# Altium project SeniorDesign_RealMixPro.PrjPcb
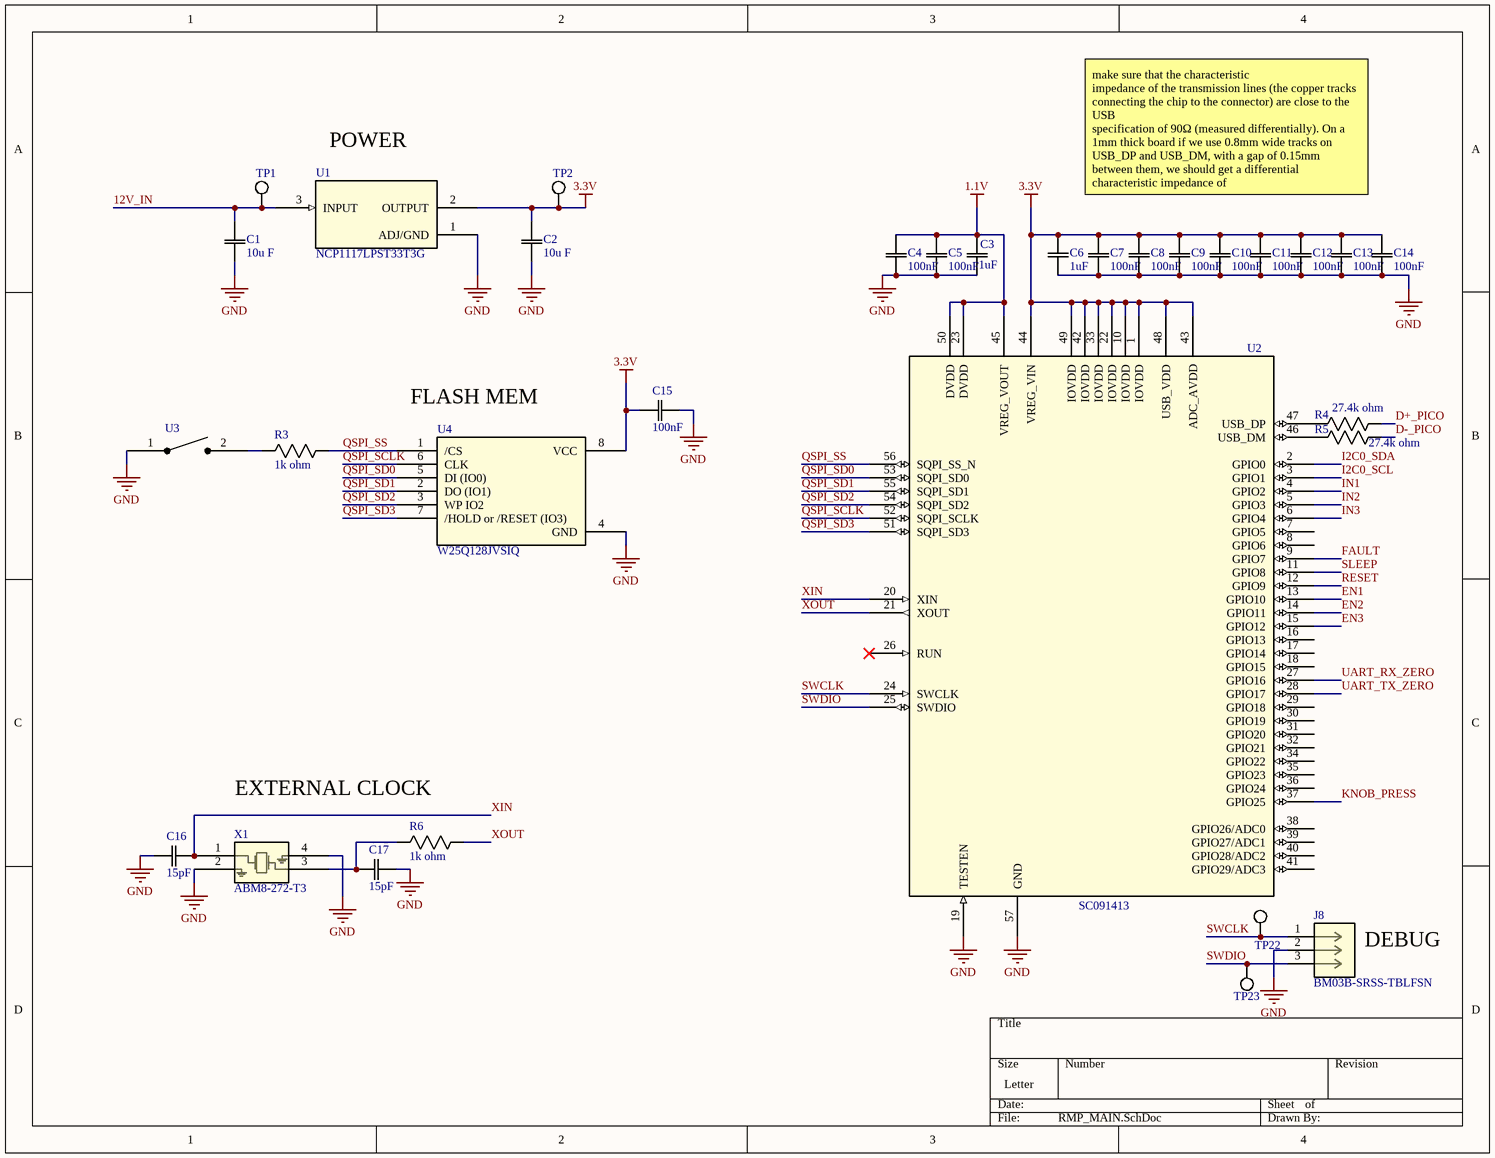
[diagram p0: RMP_MAIN.SchDoc]
7 sheets, 220 parts. Net scope: global (net labels, ports and power ports of the same name join across sheets).
Board files: RMP_MAIN_PCB.PcbDoc, RMP_MAIN_SINGLE.PcbDoc
Sheets:
  RMP_MAIN.SchDoc
  RMP_LED_MODULE.SchDoc
  RMP_MAIN_HFB.SchDoc
  RMP_SLIDER_MODULE.SchDoc
  RMP_MACRO_MODULE.SchDoc
  RMP_MAIN_ZERO.SchDoc
  USB_HUB.SchDoc

## Sheet RMP_MAIN.SchDoc
size Letter; SheetNumber: 1; SheetTotal: 7

### Parts
C1  value 10u F  [G-21_MUR-M]  (hidden comment: GRM21BR61C106KE15K)
C2  value 10u F  [G-21_MUR-M]  (hidden comment: GRM21BR61C106KE15K)
C3  value 1uF  [CAPC17595_90N_KEM-M]  (hidden comment: C0603C105K4RACTU)
C4  value 100nF  [CC0603N_YAG-M]  (hidden comment: CC0603KRX7R7BB104)
C5  value 100nF  [CC0603N_YAG-M]  (hidden comment: CC0603KRX7R7BB104)
C6  value 1uF  [CAPC17595_90N_KEM-M]  (hidden comment: C0603C105K4RACTU)
C7  value 100nF  [CC0603N_YAG-M]  (hidden comment: CC0603KRX7R7BB104)
C8  value 100nF  [CC0603N_YAG-M]  (hidden comment: CC0603KRX7R7BB104)
C9  value 100nF  [CC0603N_YAG-M]  (hidden comment: CC0603KRX7R7BB104)
C10  value 100nF  [CC0603N_YAG-M]  (hidden comment: CC0603KRX7R7BB104)
C11  value 100nF  [CC0603N_YAG-M]  (hidden comment: CC0603KRX7R7BB104)
C12  value 100nF  [CC0603N_YAG-M]  (hidden comment: CC0603KRX7R7BB104)
C13  value 100nF  [CC0603N_YAG-M]  (hidden comment: CC0603KRX7R7BB104)
C14  value 100nF  [CC0603N_YAG-M]  (hidden comment: CC0603KRX7R7BB104)
C15  value 100nF  [CC0603N_YAG-M]  (hidden comment: CC0603KRX7R7BB104)
C16  value 15pF  [CAP_CC0805_YAG-M]  (hidden comment: CC0805FRNPO9BN150)
C17  value 15pF  [CAP_CC0805_YAG-M]  (hidden comment: CC0805FRNPO9BN150)
J8  BM03B-SRSS-TBLFSN  [CONN_BM03B-SRSS-TBLFSN_JST]
R3  value 1k ohm  [RES_RNCF0805_STP-M]  (hidden comment: RNCF0805DTE1K00)
R4  value 27.4k ohm  [RESC1508X55N]  (hidden comment: MCT06030C2742FP500)
R5  value 27.4k ohm  [RESC1508X55N]  (hidden comment: MCT06030C2742FP500)
R6  value 1k ohm  [RES_RNCF0805_STP-M]  (hidden comment: RNCF0805DTE1K00)
TP1  TestPoint  [Testpoint]  (value not drawn)
TP2  TestPoint  [Testpoint]  (value not drawn)
TP22  TestPoint  [Testpoint]  (value not drawn)
TP23  TestPoint  [Testpoint]  (value not drawn)
U1  NCP1117LPST33T3G  [SOT223-3_ONS-M]
U2  SC091413  [QFN56_7X7_RPI-M]
U3  PTS636SM43SMTR LFS  [PTS636SM43SMTR LFS]  (value not drawn)
U4  W25Q128JVSIQ  [SOIC_128JVSIQ_WIN-M]
X1  ABM8-272-T3  [ABM8-272-T3_ABR]

### Nets
1.1V: C3.2 C4.2 C5.2 U2.23(DVDD) U2.45(VREG_VOUT) U2.50(DVDD)
3.3V: C2.2 C6.1 C7.2 C8.2 C9.2 C10.2 C11.2 C12.2 C13.2 C14.2 C15.2 TP2.1 U1.2(OUTPUT) U2.1(IOVDD) U2.10(IOVDD) U2.22(IOVDD) U2.33(IOVDD) U2.42(IOVDD) U2.43(ADC_AVDD) U2.44(VREG_VIN) U2.48(USB_VDD) U2.49(IOVDD) U4.8(VCC)
GND: C1.1 C2.1 C3.1 C4.1 C5.1 C6.2 C7.1 C8.1 C9.1 C10.1 C11.1 C12.1 C13.1 C14.1 C15.1 C16.1 C17.2 J8.2 U1.1(ADJ/GND) U2.19(TESTEN) U2.57(GND) U3.1 U4.4(GND) X1.2 X1.4
12V_IN: C1.2 TP1.1 U1.3(INPUT)
D+_PICO: R4.2
D-_PICO: R5.2
EN1: U2.13(GPIO10)
EN2: U2.14(GPIO11)
EN3: U2.15(GPIO12)
FAULT: U2.9(GPIO7)
I2C0_SCL: U2.3(GPIO1)
I2C0_SDA: U2.2(GPIO0)
IN1: U2.4(GPIO2)
IN2: U2.5(GPIO3)
IN3: U2.6(GPIO4)
KNOB_PRESS: U2.37(GPIO25)
QSPI_SCLK: U2.52(SQPI_SCLK) U4.6(CLK)
QSPI_SD0: U2.53(SQPI_SD0) U4.5(DI_(IO0))
QSPI_SD1: U2.55(SQPI_SD1) U4.2(DO_(IO1))
QSPI_SD2: U2.54(SQPI_SD2) U4.3(WP_IO2)
QSPI_SD3: U2.51(SQPI_SD3) U4.7(/HOLD_or_/RESET_(IO3))
QSPI_SS: R3.2 U2.56(SQPI_SS_N) U4.1(/CS)
RESET: U2.12(GPIO9)
SLEEP: U2.11(GPIO8)
SWCLK: J8.1 TP22.1 U2.24(SWCLK)
SWDIO: J8.3 TP23.1 U2.25(SWDIO)
UART_RX_ZERO: U2.27(GPIO16)
UART_TX_ZERO: U2.28(GPIO17)
XIN: C16.2 U2.20(XIN) X1.1
XOUT: R6.2 U2.21(XOUT)
NetC17_1: C17.1 R6.1 X1.3
NetR3_1: R3.1 U3.2
NetR4_1: R4.1 U2.47(USB_DP)
NetR5_1: R5.1 U2.46(USB_DM)

Not connected (* = marked no-connect by the designer): U2 7(GPIO5) 8(GPIO6) 16(GPIO13) 17(GPIO14) 18(GPIO15) 26(RUN)* 29(GPIO18) 30(GPIO19) 31(GPIO20) 32(GPIO21) 34(GPIO22) 35(GPIO23) 36(GPIO24) 38(GPIO26/ADC0) 39(GPIO27/ADC1) 40(GPIO28/ADC2) 41(GPIO29/ADC3)

### Notes on the sheet
- POWER
- make sure that the characteristic
  impedance of the transmission lines (the copper tracks connecting the chip to the connector) are close to the USB
  specification of 90Ω (measured differentially). On a 1mm thick board if we use 0.8mm wide tracks on
  USB_DP and USB_DM, with a gap of 0.15mm between them, we should get a differential characteristic impedance of
  around 90Ω
- (near U4) FLASH MEM
- EXTERNAL CLOCK
- (near J8) DEBUG

### Library data of the parts
C1 C2 = CAP_GRM21BR61C106KE15K: 10 µF ±10% 16V Ceramic Capacitor X5R 0805 (2012 Metric); Mfr_Name: Murata
C3 C6 = CAP_C0603C105K4RACTU: 1 µF ±10% 16V Ceramic Capacitor X7R 0603 (1608 Metric); Mfr_Name: Kemet
C4 C5 C7-C15 = CAP_CC0603KRX7R7BB104: 0.1 µF ±10% 16V Ceramic Capacitor X7R 0603 (1608 Metric); Mfr_Name: Yageo
C16 C17 = CAP_CC0805FRNPO9BN150: 15 pF ±1% 50V Ceramic Capacitor C0G, NP0 0805 (2012 Metric); Mfr_Name: Yageo
J8 = BM03B-SRSS-TBLFSN: No Description Available; Mfr_Name: JST; RefDes: RefDes; Type: Type
R3 R6 = RES_RNCF0805DTE1K00: 1 kOhms ±0.5% 0.25W, 1/4W Chip Resistor 0805 (2012 Metric) Automotive AEC-Q200 Thin Film; Mfr_Name: Stackpole International
R4 R5 = RES_MCT06030C2742FP500: 27.4 kOhms ±1% 0.125W, 1/8W Chip Resistor 0603 (1608 Metric) Anti-Sulfur Thin Film; Mfr_Name: Stackpole International
U1 = NCP1117LPST33T3G: Linear Voltage Regulator IC Positive Fixed 1 Output 1A SOT-223; Mfr_Name: onsemi; RefDes: RefDes; Type: Type
U2 = SC091413: ARM® Cortex®-M0+ - Microcontroller IC 32-Bit Dual-Core 133MHz External Program Memory 56-QFN (7x7); Mfr_Name: Raspberry Pi; Type: Embedded; RefDes: RefDes
U3 = PTS636SM43SMTR LFS: Tactile Switch SPST-NO Top Actuated Surface Mount
U4 = W25Q128JVSIQ: FLASH - NOR Memory IC 128Mbit SPI - Quad I/O, QPI 133 MHz 8-SOIC; Mfr_Name: Winbond; RefDes: RefDes; Type: Type
X1 = ABM8-272-T3: 12 MHz ±30ppm Crystal 10pF 50 Ohms 4-SMD, No Lead; Mfr_Name: Abracon; Type: Crystals; RefDes: RefDes

## Sheet RMP_LED_MODULE.SchDoc
size Letter; SheetNumber: 2; SheetTotal: 7
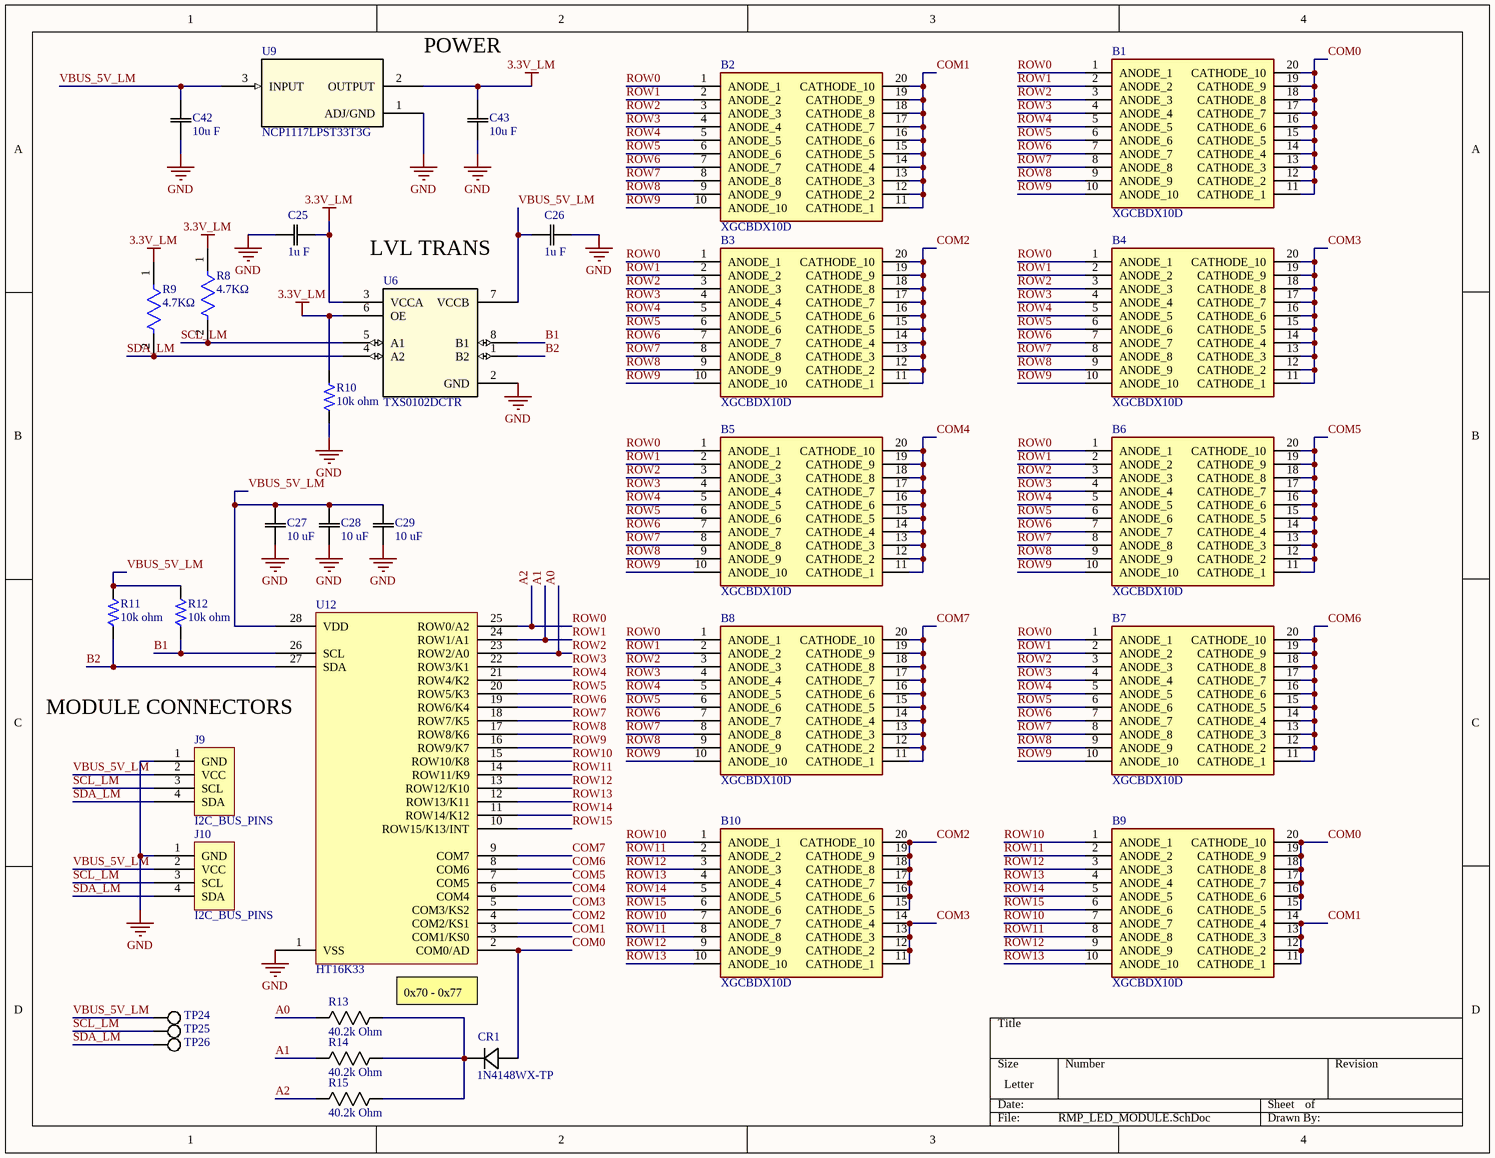
[diagram p1: RMP_LED_MODULE.SchDoc]

### Parts
B1  XGCBDX10D  [DIPS750W75P254L2540H825Q20N]
B2  XGCBDX10D  [DIPS750W75P254L2540H825Q20N]
B3  XGCBDX10D  [DIPS750W75P254L2540H825Q20N]
B4  XGCBDX10D  [DIPS750W75P254L2540H825Q20N]
B5  XGCBDX10D  [DIPS750W75P254L2540H825Q20N]
B6  XGCBDX10D  [DIPS750W75P254L2540H825Q20N]
B7  XGCBDX10D  [DIPS750W75P254L2540H825Q20N]
B8  XGCBDX10D  [DIPS750W75P254L2540H825Q20N]
B9  XGCBDX10D  [DIPS750W75P254L2540H825Q20N]
B10  XGCBDX10D  [DIPS750W75P254L2540H825Q20N]
C25  value 1u F  [CAP_CL21B105KAFNNNE_SAM-M]  (hidden comment: CL21B105KAFNNNE)
C26  value 1u F  [CAP_CL21B105KAFNNNE_SAM-M]  (hidden comment: CL21B105KAFNNNE)
C27  value 10 uF  [CAP_CL21_SAM-M]  (hidden comment: CL21A106KOQNNNE)
C28  value 10 uF  [CAP_CL21_SAM-M]  (hidden comment: CL21A106KOQNNNE)
C29  value 10 uF  [CAP_CL21_SAM-M]  (hidden comment: CL21A106KOQNNNE)
C42  value 10u F  [G-21_MUR-M]  (hidden comment: GRM21BR61C106KE15K)
C43  value 10u F  [G-21_MUR-M]  (hidden comment: GRM21BR61C106KE15K)
CR1  1N4148WX-TP  [CR_SOD323_MCC-M]
J9  I2C_BUS_PINS  [4 PIN HEADER]
J10  I2C_BUS_PINS  [4 PIN HEADER]
R8  Resistance: 4.7KΩ  [FP-RT0805-MFG]  (hidden comment: RT0805FRE134K7L)
R9  Resistance: 4.7KΩ  [FP-RT0805-MFG]  (hidden comment: RT0805FRE134K7L)
R10  value 10k ohm  [STA_RNCP0805_STP-M]  (hidden comment: RNCP0805FTD10K0)
R11  value 10k ohm  [STA_RNCP0805_STP-M]  (hidden comment: RNCP0805FTD10K0)
R12  value 10k ohm  [STA_RNCP0805_STP-M]  (hidden comment: RNCP0805FTD10K0)
R13  value 40.2k Ohm  [STA_RNCP0805_STP-M - duplicate]  (hidden comment: RNCP0805FTD40K2)
R14  value 40.2k Ohm  [STA_RNCP0805_STP-M - duplicate]  (hidden comment: RNCP0805FTD40K2)
R15  value 40.2k Ohm  [STA_RNCP0805_STP-M - duplicate]  (hidden comment: RNCP0805FTD40K2)
TP24  TestPoint  [Testpoint]  (value not drawn)
TP25  TestPoint  [Testpoint]  (value not drawn)
TP26  TestPoint  [Testpoint]  (value not drawn)
U6  TXS0102DCTR  [DCT8]
U9  NCP1117LPST33T3G  [SOT223-3_ONS-M]
U12  HT16K33  [SOP-28-300mil]

### Nets
3.3V_LM: C25.1 C43.2 R8.1 R9.1 R10.1 U6.3(VCCA) U6.6(OE) U9.2(OUTPUT)
GND: C25.2 C26.1 C27.1 C28.1 C29.1 C42.1 C43.1 J9.1(GND) J10.1(GND) R10.2 U6.2(GND) U9.1(ADJ/GND) U12.1(VSS)
A0: B1.3(ANODE_3) B2.3(ANODE_3) B3.3(ANODE_3) B4.3(ANODE_3) B5.3(ANODE_3) B6.3(ANODE_3) B7.3(ANODE_3) B8.3(ANODE_3) R13.2 U12.23(ROW2/A0)  [also labelled ROW2]
A1: B1.2(ANODE_2) B2.2(ANODE_2) B3.2(ANODE_2) B4.2(ANODE_2) B5.2(ANODE_2) B6.2(ANODE_2) B7.2(ANODE_2) B8.2(ANODE_2) R14.2 U12.24(ROW1/A1)  [also labelled ROW1]
A2: B1.1(ANODE_1) B2.1(ANODE_1) B3.1(ANODE_1) B4.1(ANODE_1) B5.1(ANODE_1) B6.1(ANODE_1) B7.1(ANODE_1) B8.1(ANODE_1) R15.2 U12.25(ROW0/A2)  [also labelled ROW0]
B1: R12.1 U6.8(B1) U12.26(SCL)
B2: R11.1 U6.1(B2) U12.27(SDA)
COM0: B1.11(CATHODE_1) B1.12(CATHODE_2) B1.13(CATHODE_3) B1.14(CATHODE_4) B1.15(CATHODE_5) B1.16(CATHODE_6) B1.17(CATHODE_7) B1.18(CATHODE_8) B1.19(CATHODE_9) B1.20(CATHODE_10) B9.15(CATHODE_5) B9.16(CATHODE_6) B9.17(CATHODE_7) B9.18(CATHODE_8) B9.19(CATHODE_9) B9.20(CATHODE_10) CR1.2 U12.2(COM0/AD)
COM1: B2.11(CATHODE_1) B2.12(CATHODE_2) B2.13(CATHODE_3) B2.14(CATHODE_4) B2.15(CATHODE_5) B2.16(CATHODE_6) B2.17(CATHODE_7) B2.18(CATHODE_8) B2.19(CATHODE_9) B2.20(CATHODE_10) B9.11(CATHODE_1) B9.12(CATHODE_2) B9.13(CATHODE_3) B9.14(CATHODE_4) U12.3(COM1/KS0)
COM2: B3.11(CATHODE_1) B3.12(CATHODE_2) B3.13(CATHODE_3) B3.14(CATHODE_4) B3.15(CATHODE_5) B3.16(CATHODE_6) B3.17(CATHODE_7) B3.18(CATHODE_8) B3.19(CATHODE_9) B3.20(CATHODE_10) B10.15(CATHODE_5) B10.16(CATHODE_6) B10.17(CATHODE_7) B10.18(CATHODE_8) B10.19(CATHODE_9) B10.20(CATHODE_10) U12.4(COM2/KS1)
COM3: B4.11(CATHODE_1) B4.12(CATHODE_2) B4.13(CATHODE_3) B4.14(CATHODE_4) B4.15(CATHODE_5) B4.16(CATHODE_6) B4.17(CATHODE_7) B4.18(CATHODE_8) B4.19(CATHODE_9) B4.20(CATHODE_10) B10.11(CATHODE_1) B10.12(CATHODE_2) B10.13(CATHODE_3) B10.14(CATHODE_4) U12.5(COM3/KS2)
COM4: B5.11(CATHODE_1) B5.12(CATHODE_2) B5.13(CATHODE_3) B5.14(CATHODE_4) B5.15(CATHODE_5) B5.16(CATHODE_6) B5.17(CATHODE_7) B5.18(CATHODE_8) B5.19(CATHODE_9) B5.20(CATHODE_10) U12.6(COM4)
COM5: B6.11(CATHODE_1) B6.12(CATHODE_2) B6.13(CATHODE_3) B6.14(CATHODE_4) B6.15(CATHODE_5) B6.16(CATHODE_6) B6.17(CATHODE_7) B6.18(CATHODE_8) B6.19(CATHODE_9) B6.20(CATHODE_10) U12.7(COM5)
COM6: B7.11(CATHODE_1) B7.12(CATHODE_2) B7.13(CATHODE_3) B7.14(CATHODE_4) B7.15(CATHODE_5) B7.16(CATHODE_6) B7.17(CATHODE_7) B7.18(CATHODE_8) B7.19(CATHODE_9) B7.20(CATHODE_10) U12.8(COM6)
COM7: B8.11(CATHODE_1) B8.12(CATHODE_2) B8.13(CATHODE_3) B8.14(CATHODE_4) B8.15(CATHODE_5) B8.16(CATHODE_6) B8.17(CATHODE_7) B8.18(CATHODE_8) B8.19(CATHODE_9) B8.20(CATHODE_10) U12.9(COM7)
ROW3: B1.4(ANODE_4) B2.4(ANODE_4) B3.4(ANODE_4) B4.4(ANODE_4) B5.4(ANODE_4) B6.4(ANODE_4) B7.4(ANODE_4) B8.4(ANODE_4) U12.22(ROW3/K1)
ROW4: B1.5(ANODE_5) B2.5(ANODE_5) B3.5(ANODE_5) B4.5(ANODE_5) B5.5(ANODE_5) B6.5(ANODE_5) B7.5(ANODE_5) B8.5(ANODE_5) U12.21(ROW4/K2)
ROW5: B1.6(ANODE_6) B2.6(ANODE_6) B3.6(ANODE_6) B4.6(ANODE_6) B5.6(ANODE_6) B6.6(ANODE_6) B7.6(ANODE_6) B8.6(ANODE_6) U12.20(ROW5/K3)
ROW6: B1.7(ANODE_7) B2.7(ANODE_7) B3.7(ANODE_7) B4.7(ANODE_7) B5.7(ANODE_7) B6.7(ANODE_7) B7.7(ANODE_7) B8.7(ANODE_7) U12.19(ROW6/K4)
ROW7: B1.8(ANODE_8) B2.8(ANODE_8) B3.8(ANODE_8) B4.8(ANODE_8) B5.8(ANODE_8) B6.8(ANODE_8) B7.8(ANODE_8) B8.8(ANODE_8) U12.18(ROW7/K5)
ROW8: B1.9(ANODE_9) B2.9(ANODE_9) B3.9(ANODE_9) B4.9(ANODE_9) B5.9(ANODE_9) B6.9(ANODE_9) B7.9(ANODE_9) B8.9(ANODE_9) U12.17(ROW8/K6)
ROW9: B1.10(ANODE_10) B2.10(ANODE_10) B3.10(ANODE_10) B4.10(ANODE_10) B5.10(ANODE_10) B6.10(ANODE_10) B7.10(ANODE_10) B8.10(ANODE_10) U12.16(ROW9/K7)
ROW10: B9.1(ANODE_1) B9.7(ANODE_7) B10.1(ANODE_1) B10.7(ANODE_7) U12.15(ROW10/K8)
ROW11: B9.2(ANODE_2) B9.8(ANODE_8) B10.2(ANODE_2) B10.8(ANODE_8) U12.14(ROW11/K9)
ROW12: B9.3(ANODE_3) B9.9(ANODE_9) B10.3(ANODE_3) B10.9(ANODE_9) U12.13(ROW12/K10)
ROW13: B9.4(ANODE_4) B9.10(ANODE_10) B10.4(ANODE_4) B10.10(ANODE_10) U12.12(ROW13/K11)
ROW14: B9.5(ANODE_5) B10.5(ANODE_5) U12.11(ROW14/K12)
ROW15: B9.6(ANODE_6) B10.6(ANODE_6) U12.10(ROW15/K13/INT)
SCL_LM: J9.3(SCL) J10.3(SCL) R8.2 TP25.1 U6.5(A1)
SDA_LM: J9.4(SDA) J10.4(SDA) R9.2 TP26.1 U6.4(A2)
VBUS_5V_LM: C26.2 C27.2 C28.2 C29.2 C42.2 J9.2(VCC) J10.2(VCC) R11.2 R12.2 TP24.1 U6.7(VCCB) U9.3(INPUT) U12.28(VDD)
NetCR1_1: CR1.1 R13.1 R14.1 R15.1

### Notes on the sheet
- POWER
- (near U6) LVL TRANS
- (near J9) MODULE CONNECTORS
- 0x70 - 0x77

### Library data of the parts
B1-B10 = XGCBDX10D: BARGRAPH 10-SEGMENT BLUE; Manufacturer_Name: SunLED; Geometry.Height: 8.25mm; Manufacturer_Part_Number: XGCBDX10D; Mouser Part Number: *; Mouser Price/Stock: *; Arrow Part Number: *; Arrow Price/Stock: *; Datasheet Link: https://www.sunledusa.com/products/spec/XGCBDX10D.pdf
C25 C26 = CAP_CL21B105KAFNNNE: 1 µF ±10% 25V Ceramic Capacitor X7R 0805 (2012 Metric); Mfr_Name: Samsung
C27-C29 = CAP_CL21A106KOQNNNE: 10 µF ±10% 16V Ceramic Capacitor X5R 0805 (2012 Metric)
C42 C43 = CAP_GRM21BR61C106KE15K: as C1 on sheet RMP_MAIN
CR1 = 1N4148WX-TP: No Description Available; Mfr_Name: MCC
R8 R9 = CMP-03412-025396-1: RT0805 4.7KΩ 0.125W 50 ppm/°C 0.01%; Manufacturer: Yageo; Tolerance: 0.0001; Voltage Rating: 150V; Category: Res; Footprint Url: http://www.yageo.com/exep/pages/download/literatures/PYu-R_Mount_10.pdf; Package: RT0805; Composition: Thin Film; Device Class L3: Chip SMD Resistors; Ipc Land Pattern Name: RESC200125X50; Temperature Range Low: -55°C; Lead Free: Yes; Temperature Range High: +155°C; Temperature Coefficient: 50 ppm/°C; Octopart: https://octopart.com/rt0805fre134k7l-yageo-16262042; ComponentLink2URL: http://www.yageo.com/documents/recent/PYu-RT_1-to-0.01_RoHS_L_9.pdf; Device Class L1: Passive Components; Value: 4.7KΩ; Automotive: No; Height: 0.6mm; Device Class L2: Resistors; RoHS: TRUE; Manufacturer Part Number: RT0805FRE134K7L; Power Rating: 0.125W; Temperature: -55°C to +155°C; Series: RT; ComponentLink2Description: Datasheet
R10-R12 = RES_RNCP0805FTD10K0: 10 kOhms ±1% 0.25W, 1/4W Chip Resistor 0805 (2012 Metric) Anti-Sulfur Thin Film; Supplier 1: Digikey; Supplier Part Number 1: RNCP0805FTD10K0CT-ND
R13-R15 = RES_RNCP0805FTD40K2: 40.2 kOhms ±1% 0.25W, 1/4W Chip Resistor 0805 (2012 Metric) Anti-Sulfur Thin Film; Mfr_Name: Stackpole International
U6 = TXS0102DCTR: Voltage Level Translator Bidirectional 1 Circuit 2 Channel 24Mbps SM8; Mfr_Name: Texas Instruments; RefDes: RefDes; Type: Type
U9 = NCP1117LPST33T3G: as U1 on sheet RMP_MAIN; RefDes: RefDes; Type: Type
U12 = HT16K33: 16X8 LED MAtrix Driver

## Sheet RMP_MAIN_HFB.SchDoc
size A; SheetNumber: 3; SheetTotal: 7
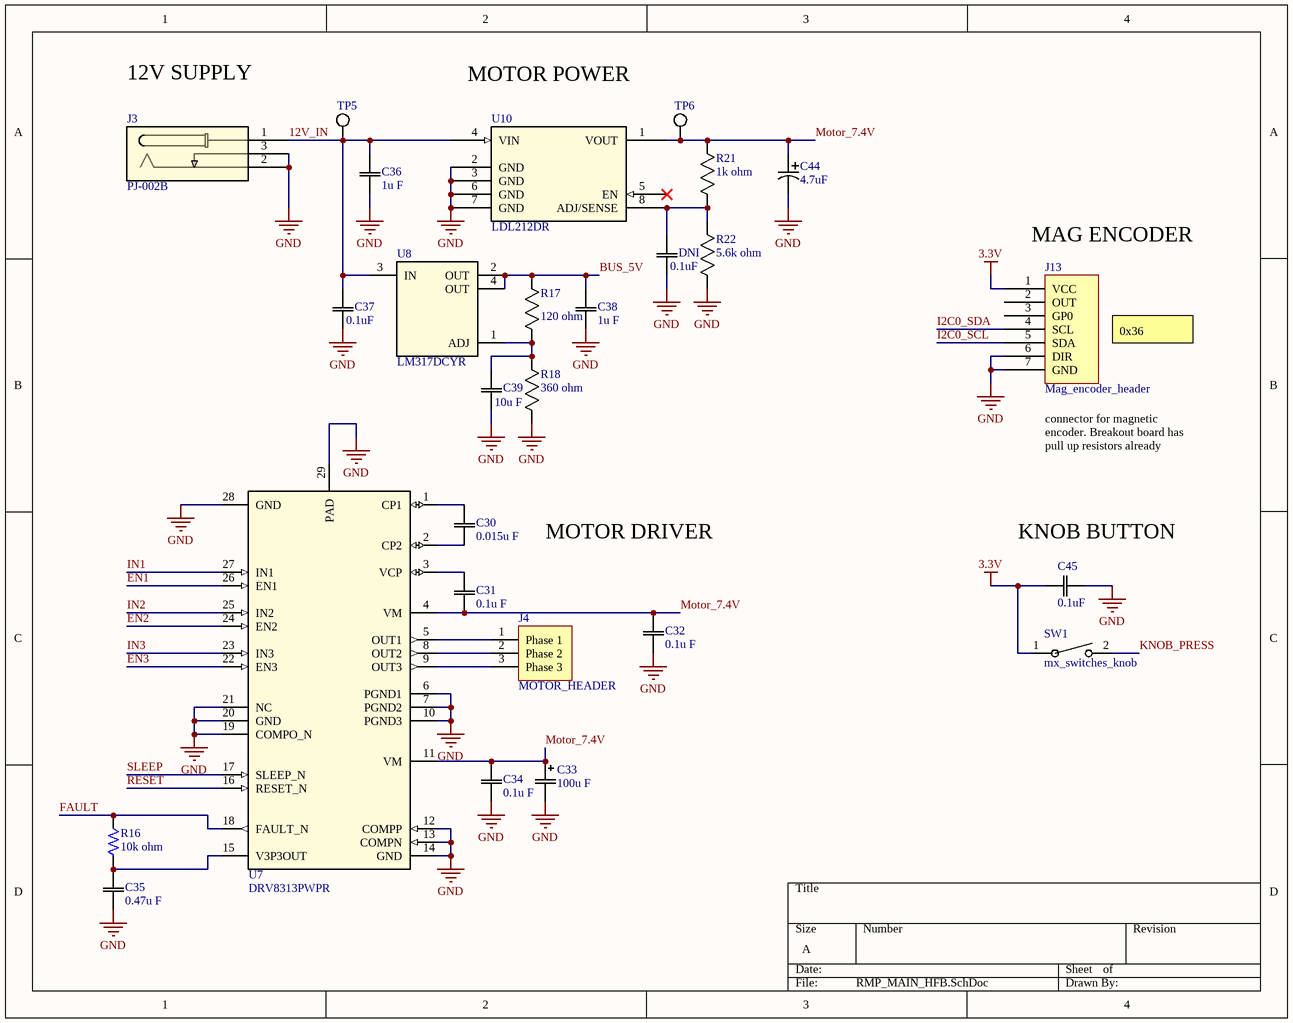
[diagram p2: RMP_MAIN_HFB.SchDoc]

### Parts
C30  value 0.015u F  [CC0805N_YAG-M]  (hidden comment: CC0805KRX7R9BB153)
C31  value 0.1u F  [CC0805N_YAG-M]  (hidden comment: CC0805KRX7R9BB104)
C32  value 0.1u F  [CC0805N_YAG-M]  (hidden comment: CC0805KRX7R9BB104)
C33  value 100u F  [CAP_YX_6P3X11_RUB]  (hidden comment: 35YXJ100M6.3X11)
C34  value 0.1u F  [CC0805N_YAG-M]  (hidden comment: CC0805KRX7R9BB104)
C35  value 0.47u F  [CC0805N_YAG-M]  (hidden comment: CC0805KKX7R8BB474)
C36  value 1u F  [CAP_CL21B105KAFNNNE_SAM-M]  (hidden comment: CL21B105KAFNNNE)
C37  value 0.1uF  [CC0805N_YAG-M]  (hidden comment: CC0805KRX7R9BB104)
C38  value 1u F  [CAP_CL21B105KAFNNNE_SAM-M]  (hidden comment: CL21B105KAFNNNE)
C39  value 10u F  [G-21_MUR-M]  (hidden comment: GRM21BR61C106KE15K)
C44  value 4.7uF  [TAJA_AVX-M]  (hidden comment: TAJA475K016RNJ)
C45  value 0.1uF  [CC0805N_YAG-M]  (hidden comment: CC0805KRX7R9BB104)
DNI  value 0.1uF  [CC0805N_YAG-M]  (hidden comment: CC0805KRX7R9BB104)
J3  PJ-002B  [PJ-002B_CUI]
J4  MOTOR_HEADER  [3PINHEADER]
J13  Mag_encoder_header  [8PinHeader]
R16  value 10k ohm  [STA_RNCP0805_STP-M]  (hidden comment: RNCP0805FTD10K0)
R17  value 120 ohm  [RES_RNCF0805_STP-M]  (hidden comment: RNCF0805DTE120R)
R18  value 360 ohm  [RES_RNCF0805_STP-M]  (hidden comment: RNCF0805DTE360R)
R21  value 1k ohm  [RES_RNCF0805_STP-M]  (hidden comment: RNCF0805DTE1K00)
R22  value 5.6k ohm  [RES_RNCF0805_STP-M]  (hidden comment: RNCF0805DTE5K60)
SW1  mx_switches_knob  [knob_switches]
TP5  TestPoint  [Testpoint]  (value not drawn)
TP6  TestPoint  [Testpoint]  (value not drawn)
U7  DRV8313PWPR  [PWP0028F_M]
U8  LM317DCYR  [DCY0004A_M]
U10  LDL212DR  [SO8B_4X5X1P27_STM]

### Nets
3.3V: C45.2 J13.1(VCC) SW1.1
GND: C32.1 C33.2 C34.1 C35.1 C36.1 C37.1 C38.1 C39.1 C44.2 C45.1 DNI.1 J3.2 J3.3 J13.6(DIR) J13.7(GND) R18.1 R22.1 U7.6(PGND1) U7.7(PGND2) U7.10(PGND3) U7.12(COMPP) U7.13(COMPN) U7.14(GND) U7.19(COMPO_N) U7.20(GND) U7.21(NC) U7.28(GND) U7.29(PAD) U10.2(GND) U10.3(GND) U10.6(GND) U10.7(GND)
12V_IN: C36.2 C37.2 J3.1 TP5.1 U8.3(IN) U10.4(VIN)
BUS_5V: C38.2 R17.2 U8.2(OUT) U8.4(OUT)
EN1: U7.26(EN1)
EN2: U7.24(EN2)
EN3: U7.22(EN3)
FAULT: R16.2 U7.18(FAULT_N)
I2C0_SCL: J13.5(SDA)
I2C0_SDA: J13.4(SCL)
IN1: U7.27(IN1)
IN2: U7.25(IN2)
IN3: U7.23(IN3)
KNOB_PRESS: SW1.2
Motor_7.4V: C31.1 C32.2 C33.1 C34.2 C44.1 R21.2 TP6.1 U7.4(VM) U7.11(VM) U10.1(VOUT)
RESET: U7.16(RESET_N)
SLEEP: U7.17(SLEEP_N)
NetC30_1: C30.1 U7.2(CP2)
NetC30_2: C30.2 U7.1(CP1)
NetC31_2: C31.2 U7.3(VCP)
NetC35_2: C35.2 R16.1 U7.15(V3P3OUT)
NetC39_2: C39.2 R17.1 R18.2 U8.1(ADJ)
NetDNI_2: DNI.2 R21.1 R22.2 U10.8(ADJ/SENSE)
NetJ4_1: J4.1(Phase_1) U7.5(OUT1)
NetJ4_2: J4.2(Phase_2) U7.8(OUT2)
NetJ4_3: J4.3(Phase_3) U7.9(OUT3)

Not connected (* = marked no-connect by the designer): J13 2(OUT) 3(GP0); U10 5(EN)*

### Notes on the sheet
- 12V SUPPLY
- (near U10) MOTOR POWER
- (near J13) MAG ENCODER
- 0x36
- (near J13) connector for magnetic encoder. Breakout board has pull up resistors already
- MOTOR DRIVER
- (near C45) KNOB BUTTON

### Library data of the parts
C30 = CAP_CC0805KRX7R9BB153: 0.015 µF ±10% 50V Ceramic Capacitor X7R 0805 (2012 Metric); Mfr_Name: Yageo
C31 C32 C34 C37 C45 DNI = CAP_CC0805KRX7R9BB104: 0.1 µF ±10% 50V Ceramic Capacitor X7R 0805 (2012 Metric); Mfr_Name: Yageo
C33 = CAP_35YXJ100M6.3X11: CAP ALUM 100UF 20% 35V RADIAL TH; Mfr_Name: Rubycon
C35 = CAP_CC0805KKX7R8BB474: 0.47 µF ±10% 25V Ceramic Capacitor X7R 0805 (2012 Metric); Mfr_Name: Yageo
C36 C38 = CAP_CL21B105KAFNNNE: as C25 on sheet RMP_LED_MODULE
C39 = CAP_GRM21BR61C106KE15K: as C1 on sheet RMP_MAIN
C44 = CAP_TAJA475K016RNJ: 4.7 µF Molded Tantalum Capacitors 16 V 1206 (3216 Metric) 4Ohm; Mfr_Name: KYOCERA AVX
J3 = PJ-002B: Power Barrel Connector Jack 2.50mm ID (0.098"), 5.50mm OD (0.217") Through Hole, Right Angle; Mfr_Name: CUI Inc; RefDes: RefDes; Type: Type
J4 = MOTOR_HEADER: BLDC motor header
R16 = RES_RNCP0805FTD10K0: as R10 on sheet RMP_LED_MODULE; Supplier 1: Digikey; Supplier Part Number 1: RNCP0805FTD10K0CT-ND
R17 = RES_RNCF0805DTE120R: 120 Ohms ±0.5% 0.25W, 1/4W Chip Resistor 0805 (2012 Metric) Automotive AEC-Q200 Thin Film; Mfr_Name: Stackpole International
R18 = RES_RNCF0805DTE360R: 360 Ohms ±0.5% 0.25W, 1/4W Chip Resistor 0805 (2012 Metric) Automotive AEC-Q200 Thin Film; Mfr_Name: Stackpole International
R21 = RES_RNCF0805DTE1K00: as R3 on sheet RMP_MAIN
R22 = RES_RNCF0805DTE5K60: 5.6 kOhms ±0.5% 0.25W, 1/4W Chip Resistor 0805 (2012 Metric) Automotive AEC-Q200 Thin Film; Mfr_Name: Stackpole International
SW1 = mx_switches_knob: No Description Available; Mfr_Name: Cherry
U7 = DRV8313PWPR: IC MOTOR DRIVER 8V-60V 28HTSSOP; Mfr_Name: Texas Instruments; TYPE: TYPE; RefDes: RefDes
U8 = LM317DCYR: Linear Voltage Regulator IC Positive Adjustable 1 Output 1.5A SOT-223-4; Mfr_Name: Texas Instruments; SymbolCreater: Altium; TYPE: TYPE; RefDes: RefDes; PartNumber: LM317DCYR; Alternate_PartNumber: LM317DCY; PackageReference: DCY0004A; MountType: SMT; CompType: IC; RoHS: Y; Manufacturer: Texas Instruments
U10 = LDL212DR: Linear Voltage Regulator IC Positive Adjustable 1 Output 1.2A 8-SO; Mfr_Name: STMicroelectronics; RefDes: RefDes; Type: Type

## Sheet RMP_SLIDER_MODULE.SchDoc
size Letter; SheetNumber: 4; SheetTotal: 7
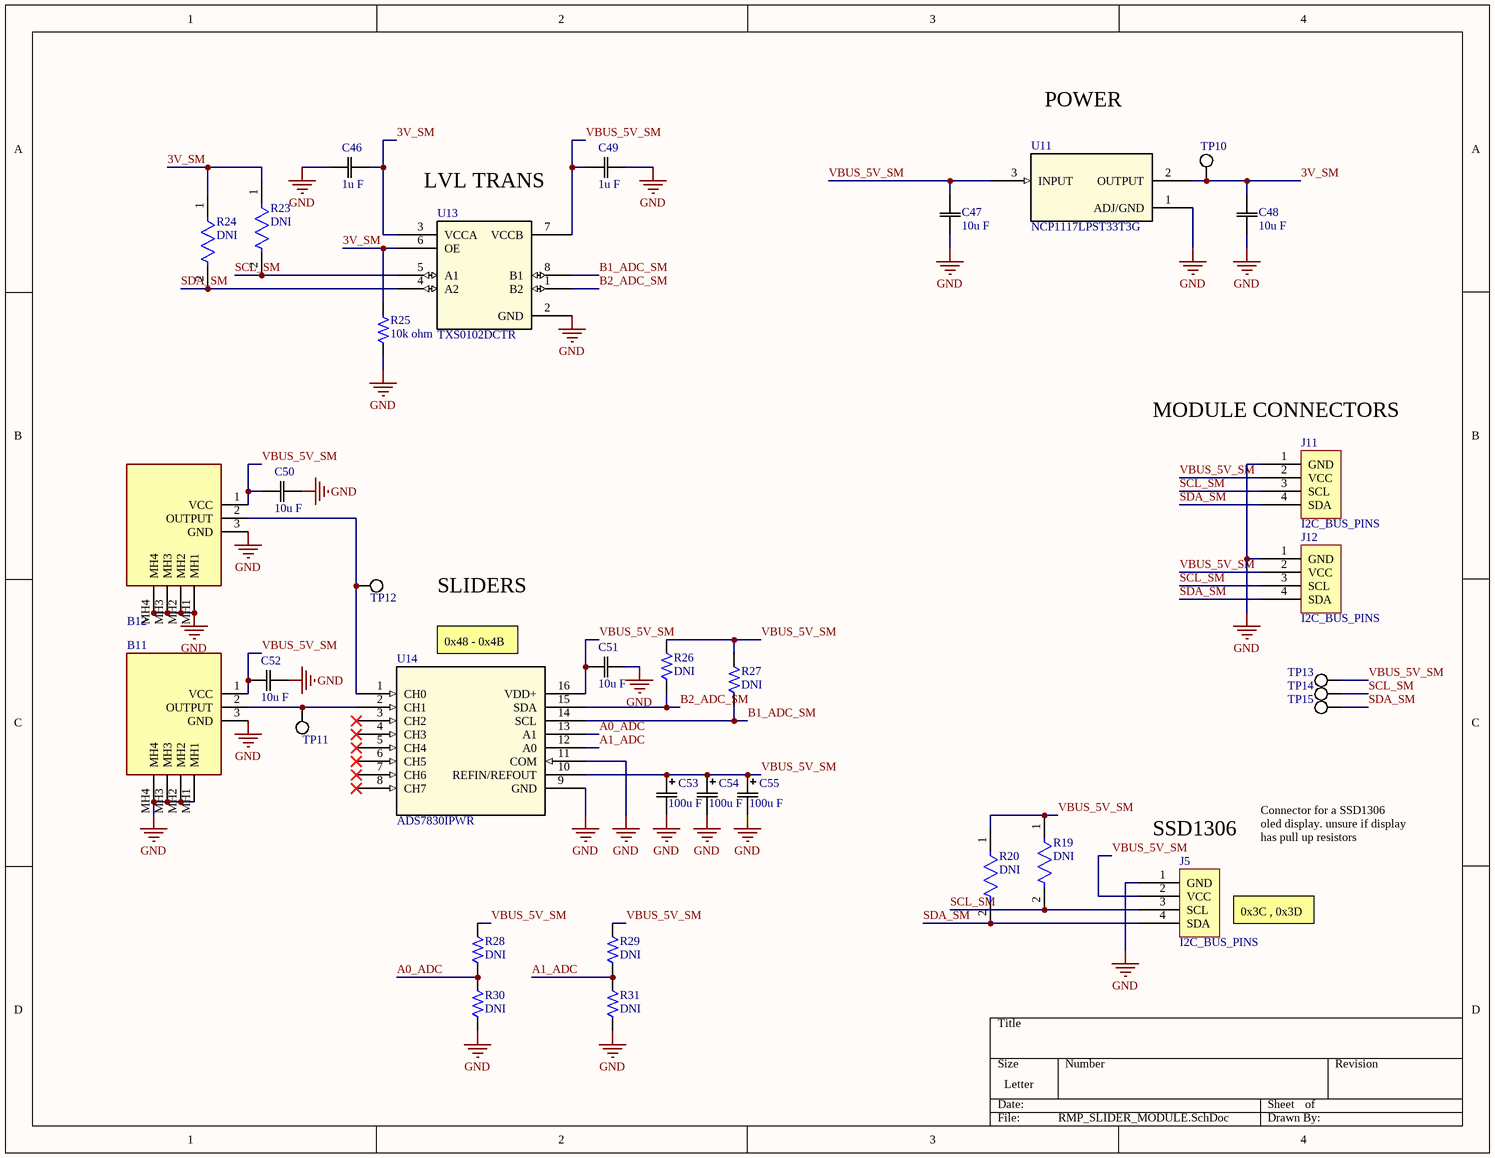
[diagram p3: RMP_SLIDER_MODULE.SchDoc]

### Parts
B11  PTA3043-2010CIB103  [PTA30432010CIB103]  (value not drawn)
B12  PTA3043-2010CIB103  [PTA30432010CIB103]  (value not drawn)
C46  value 1u F  [CAP_CL21B105KAFNNNE_SAM-M]  (hidden comment: CL21B105KAFNNNE)
C47  value 10u F  [G-21_MUR-M]  (hidden comment: GRM21BR61C106KE15K)
C48  value 10u F  [G-21_MUR-M]  (hidden comment: GRM21BR61C106KE15K)
C49  value 1u F  [CAP_CL21B105KAFNNNE_SAM-M]  (hidden comment: CL21B105KAFNNNE)
C50  value 10u F  [G-21_MUR-M]  (hidden comment: GRM21BR61C106KE15K)
C51  value 10u F  [G-21_MUR-M]  (hidden comment: GRM21BR61C106KE15K)
C52  value 10u F  [G-21_MUR-M]  (hidden comment: GRM21BR61C106KE15K)
C53  value 100u F  [CAP_YX_6P3X11_RUB]  (hidden comment: 35YXJ100M6.3X11)
C54  value 100u F  [CAP_YX_6P3X11_RUB]  (hidden comment: 35YXJ100M6.3X11)
C55  value 100u F  [CAP_YX_6P3X11_RUB]  (hidden comment: 35YXJ100M6.3X11)
J5  I2C_BUS_PINS  [4 PIN HEADER]
J11  I2C_BUS_PINS  [4 PIN HEADER]
J12  I2C_BUS_PINS  [4 PIN HEADER]
R19  Resistance: DNI  [FP-RT0805-MFG]  (hidden comment: RT0805FRE134K7L)
R20  Resistance: DNI  [FP-RT0805-MFG]  (hidden comment: RT0805FRE134K7L)
R23  Resistance: DNI  [FP-RT0805-MFG]  (hidden comment: RT0805FRE134K7L)
R24  Resistance: DNI  [FP-RT0805-MFG]  (hidden comment: RT0805FRE134K7L)
R25  value 10k ohm  [STA_RNCP0805_STP-M]  (hidden comment: RNCP0805FTD10K0)
R26  value DNI  [STA_RNCP0805_STP-M]  (hidden comment: RNCP0805FTD10K0)
R27  value DNI  [STA_RNCP0805_STP-M]  (hidden comment: RNCP0805FTD10K0)
R28  value DNI  [STA_RNCP0805_STP-M]  (hidden comment: RNCP0805FTD10K0)
R29  value DNI  [STA_RNCP0805_STP-M]  (hidden comment: RNCP0805FTD10K0)
R30  value DNI  [STA_RNCP0805_STP-M]  (hidden comment: RNCP0805FTD10K0)
R31  value DNI  [STA_RNCP0805_STP-M]  (hidden comment: RNCP0805FTD10K0)
TP10  TestPoint  [Testpoint]  (value not drawn)
TP11  TestPoint  [Testpoint]  (value not drawn)
TP12  TestPoint  [Testpoint]  (value not drawn)
TP13  TestPoint  [Testpoint]  (value not drawn)
TP14  TestPoint  [Testpoint]  (value not drawn)
TP15  TestPoint  [Testpoint]  (value not drawn)
U11  NCP1117LPST33T3G  [SOT223-3_ONS-M]
U13  TXS0102DCTR  [DCT8]
U14  ADS7830IPWR  [PW16-M]

### Nets
GND: B11.3(GND) B11.MH1 B11.MH2 B11.MH3 B11.MH4 B12.3(GND) B12.MH1 B12.MH2 B12.MH3 B12.MH4 C46.2 C47.1 C48.1 C49.1 C50.1 C51.1 C52.2 C53.2 C54.2 C55.2 J5.1(GND) J11.1(GND) J12.1(GND) R25.2 R30.1 R31.1 U11.1(ADJ/GND) U13.2(GND) U14.9(GND) U14.11(COM)
3V_SM: C46.1 C48.2 R23.1 R24.1 R25.1 TP10.1 U11.2(OUTPUT) U13.3(VCCA) U13.6(OE)
A0_ADC: R28.1 R30.2 U14.13(A1)
A1_ADC: R29.1 R31.2 U14.12(A0)
B1_ADC_SM: R27.1 U13.8(B1) U14.14(SCL)
B2_ADC_SM: R26.1 U13.1(B2) U14.15(SDA)
SCL_SM: J5.3(SCL) J11.3(SCL) J12.3(SCL) R19.2 R23.2 TP14.1 U13.5(A1)
SDA_SM: J5.4(SDA) J11.4(SDA) J12.4(SDA) R20.2 R24.2 TP15.1 U13.4(A2)
VBUS_5V_SM: B11.1(VCC) B12.1(VCC) C47.2 C49.2 C50.2 C51.2 C52.1 C53.1 C54.1 C55.1 J5.2(VCC) J11.2(VCC) J12.2(VCC) R19.1 R20.1 R26.2 R27.2 R28.2 R29.2 TP13.1 U11.3(INPUT) U13.7(VCCB) U14.10(REFIN/REFOUT) U14.16(VDD+)
NetB11_2: B11.2(OUTPUT) TP11.1 U14.2(CH1)
NetB12_2: B12.2(OUTPUT) TP12.1 U14.1(CH0)

Not connected (* = marked no-connect by the designer): U14 3(CH2)* 4(CH3)* 5(CH4)* 6(CH5)* 7(CH6)* 8(CH7)*

### Notes on the sheet
- POWER
- (near U13) LVL TRANS
- (near J11) MODULE CONNECTORS
- SLIDERS
- (near U14) 0x48 - 0x4B
- (near J5) SSD1306
- Connector for a SSD1306 oled display. unsure if display has pull up resistors
- 0x3C , 0x3D

### Library data of the parts
B11 B12 = PTA3043-2010CIB103: 10 kOhms 0.2W, 1/5W Through Hole Slide Potentiometer Top Adjustment Type; Manufacturer_Name: Bourns; Geometry.Height: 16.5mm; Manufacturer_Part_Number: PTA3043-2010CIB103; Mouser Part Number: 652-PTA3432010CIB103; Mouser Price/Stock: https://www.mouser.co.uk/ProductDetail/Bourns/PTA3043-2010CIB103?qs=QARuOjD9jaF0iQfIvhCxcQ%3D%3D; Arrow Part Number: PTA3043-2010CIB103; Arrow Price/Stock: null?utm_currency=USD&region=nac; Datasheet Link: https://www.bourns.com/docs/Product-Datasheets/pta.pdf
C46 C49 = CAP_CL21B105KAFNNNE: as C25 on sheet RMP_LED_MODULE
C47 C48 C50-C52 = CAP_GRM21BR61C106KE15K: as C1 on sheet RMP_MAIN
C53-C55 = CAP_35YXJ100M6.3X11: as C33 on sheet RMP_MAIN_HFB
R19 R20 R23 R24 = CMP-03412-025396-1: as R8 on sheet RMP_LED_MODULE; Category: Res; Footprint Url: http://www.yageo.com/exep/pages/download/literatures/PYu-R_Mount_10.pdf; Package: RT0805; Composition: Thin Film; Device Class L3: Chip SMD Resistors; Ipc Land Pattern Name: RESC200125X50; Temperature Range Low: -55°C; Lead Free: Yes; Temperature Range High: +155°C; Temperature Coefficient: 50 ppm/°C; Octopart: https://octopart.com/rt0805fre134k7l-yageo-16262042; ComponentLink2URL: http://www.yageo.com/documents/recent/PYu-RT_1-to-0.01_RoHS_L_9.pdf; Device Class L1: Passive Components; Value: 4.7KΩ; Automotive: No; Height: 0.6mm; Device Class L2: Resistors; RoHS: TRUE; Manufacturer Part Number: RT0805FRE134K7L; Power Rating: 0.125W; Temperature: -55°C to +155°C; Series: RT; ComponentLink2Description: Datasheet
R25-R31 = RES_RNCP0805FTD10K0: as R10 on sheet RMP_LED_MODULE; Supplier 1: Digikey; Supplier Part Number 1: RNCP0805FTD10K0CT-ND
U11 = NCP1117LPST33T3G: as U1 on sheet RMP_MAIN; RefDes: RefDes; Type: Type
U13 = TXS0102DCTR: as U6 on sheet RMP_LED_MODULE; RefDes: RefDes; Type: Type
U14 = ADS7830IPWR: 8 Bit Analog to Digital Converter 4, 8 Input 1 SAR 16-TSSOP; Mfr_Name: Texas Instruments; RefDes: RefDes; Type: Type

## Sheet RMP_MACRO_MODULE.SchDoc
size Letter; SheetNumber: 5; SheetTotal: 7
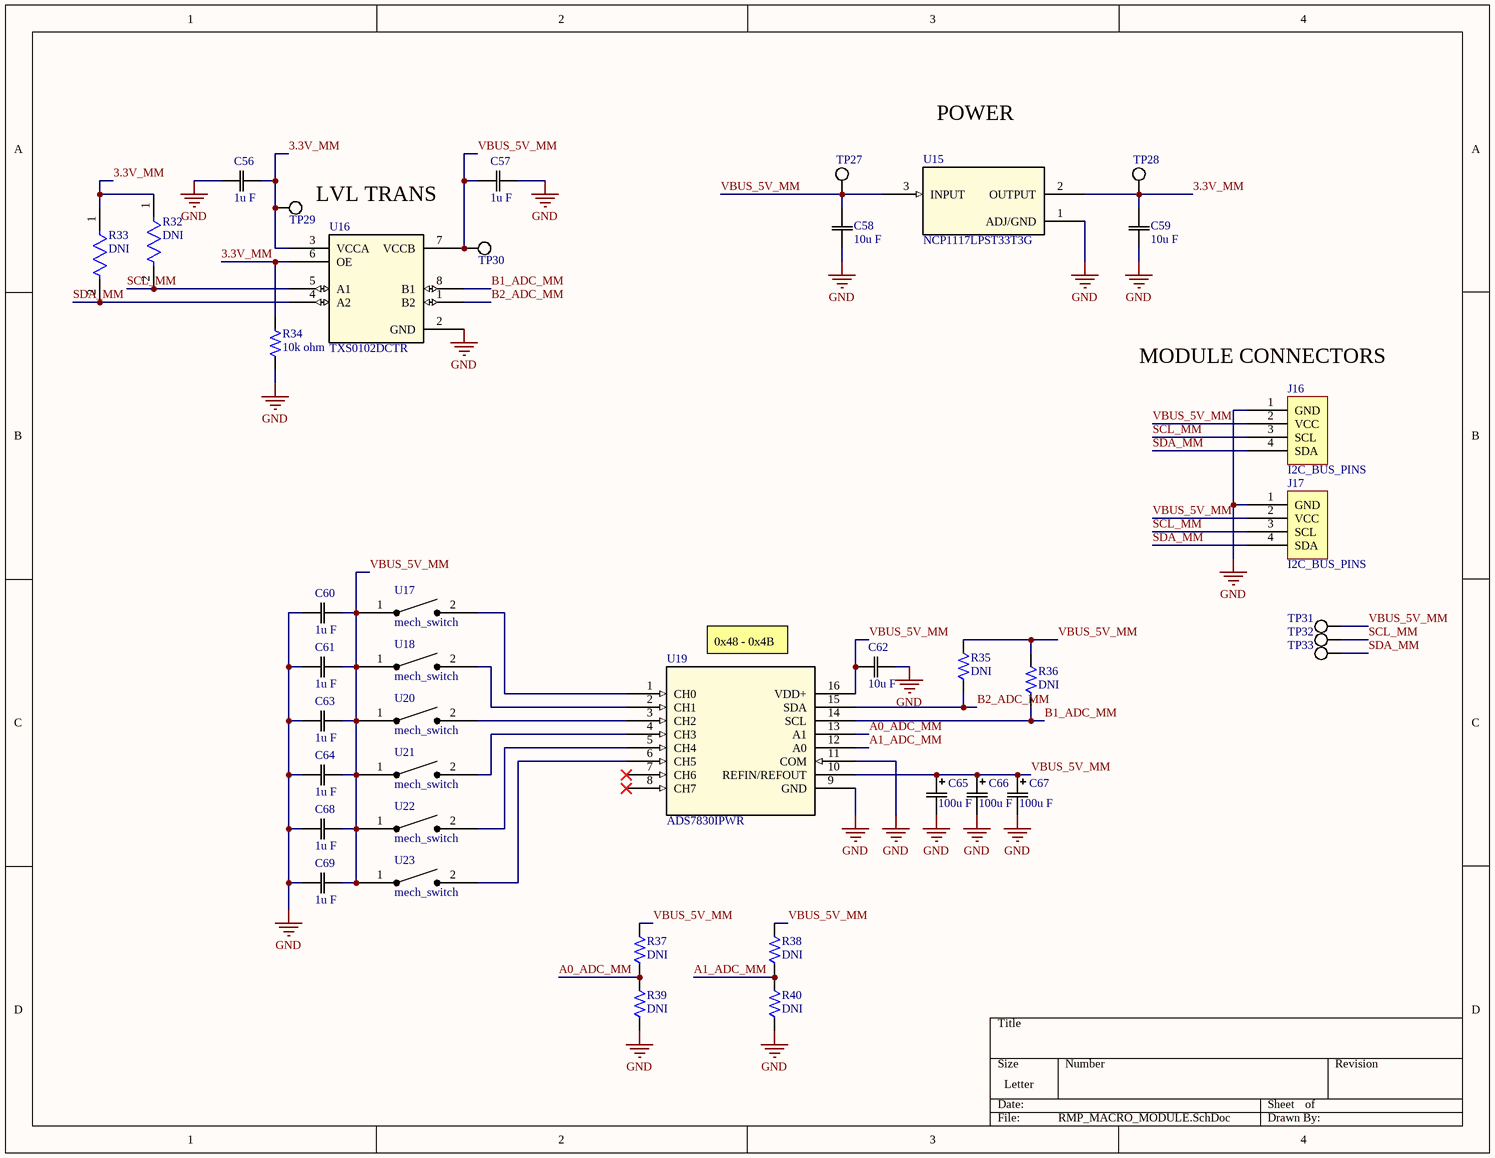
[diagram p4: RMP_MACRO_MODULE.SchDoc]

### Parts
C56  value 1u F  [CAP_CL21B105KAFNNNE_SAM-M]  (hidden comment: CL21B105KAFNNNE)
C57  value 1u F  [CAP_CL21B105KAFNNNE_SAM-M]  (hidden comment: CL21B105KAFNNNE)
C58  value 10u F  [G-21_MUR-M]  (hidden comment: GRM21BR61C106KE15K)
C59  value 10u F  [G-21_MUR-M]  (hidden comment: GRM21BR61C106KE15K)
C60  value 1u F  [CAP_CL21B105KAFNNNE_SAM-M]  (hidden comment: CL21B105KAFNNNE)
C61  value 1u F  [CAP_CL21B105KAFNNNE_SAM-M]  (hidden comment: CL21B105KAFNNNE)
C62  value 10u F  [G-21_MUR-M]  (hidden comment: GRM21BR61C106KE15K)
C63  value 1u F  [CAP_CL21B105KAFNNNE_SAM-M]  (hidden comment: CL21B105KAFNNNE)
C64  value 1u F  [CAP_CL21B105KAFNNNE_SAM-M]  (hidden comment: CL21B105KAFNNNE)
C65  value 100u F  [CAP_YX_6P3X11_RUB]  (hidden comment: 35YXJ100M6.3X11)
C66  value 100u F  [CAP_YX_6P3X11_RUB]  (hidden comment: 35YXJ100M6.3X11)
C67  value 100u F  [CAP_YX_6P3X11_RUB]  (hidden comment: 35YXJ100M6.3X11)
C68  value 1u F  [CAP_CL21B105KAFNNNE_SAM-M]  (hidden comment: CL21B105KAFNNNE)
C69  value 1u F  [CAP_CL21B105KAFNNNE_SAM-M]  (hidden comment: CL21B105KAFNNNE)
J16  I2C_BUS_PINS  [4 PIN HEADER]
J17  I2C_BUS_PINS  [4 PIN HEADER]
R32  Resistance: DNI  [FP-RT0805-MFG]  (hidden comment: RT0805FRE134K7L)
R33  Resistance: DNI  [FP-RT0805-MFG]  (hidden comment: RT0805FRE134K7L)
R34  value 10k ohm  [STA_RNCP0805_STP-M]  (hidden comment: RNCP0805FTD10K0)
R35  value DNI  [STA_RNCP0805_STP-M]  (hidden comment: RNCP0805FTD10K0)
R36  value DNI  [STA_RNCP0805_STP-M]  (hidden comment: RNCP0805FTD10K0)
R37  value DNI  [STA_RNCP0805_STP-M]  (hidden comment: RNCP0805FTD10K0)
R38  value DNI  [STA_RNCP0805_STP-M]  (hidden comment: RNCP0805FTD10K0)
R39  value DNI  [STA_RNCP0805_STP-M]  (hidden comment: RNCP0805FTD10K0)
R40  value DNI  [STA_RNCP0805_STP-M]  (hidden comment: RNCP0805FTD10K0)
TP27  TestPoint  [Testpoint]  (value not drawn)
TP28  TestPoint  [Testpoint]  (value not drawn)
TP29  TestPoint  [Testpoint]  (value not drawn)
TP30  TestPoint  [Testpoint]  (value not drawn)
TP31  TestPoint  [Testpoint]  (value not drawn)
TP32  TestPoint  [Testpoint]  (value not drawn)
TP33  TestPoint  [Testpoint]  (value not drawn)
U15  NCP1117LPST33T3G  [SOT223-3_ONS-M]
U16  TXS0102DCTR  [DCT8]
U17  mech_switch  [SW_MX1A-E1NW_CHY]
U18  mech_switch  [SW_MX1A-E1NW_CHY]
U19  ADS7830IPWR  [PW16-M]
U20  mech_switch  [SW_MX1A-E1NW_CHY]
U21  mech_switch  [SW_MX1A-E1NW_CHY]
U22  mech_switch  [SW_MX1A-E1NW_CHY]
U23  mech_switch  [SW_MX1A-E1NW_CHY]

### Nets
GND: C56.2 C57.1 C58.1 C59.1 C60.2 C61.2 C62.1 C63.2 C64.2 C65.2 C66.2 C67.2 C68.2 C69.2 J16.1(GND) J17.1(GND) R34.2 R39.1 R40.1 U15.1(ADJ/GND) U16.2(GND) U19.9(GND) U19.11(COM)
3.3V_MM: C56.1 C59.2 R32.1 R33.1 R34.1 TP28.1 TP29.1 U15.2(OUTPUT) U16.3(VCCA) U16.6(OE)
A0_ADC_MM: R37.1 R39.2 U19.13(A1)
A1_ADC_MM: R38.1 R40.2 U19.12(A0)
B1_ADC_MM: R36.1 U16.8(B1) U19.14(SCL)
B2_ADC_MM: R35.1 U16.1(B2) U19.15(SDA)
SCL_MM: J16.3(SCL) J17.3(SCL) R32.2 TP32.1 U16.5(A1)
SDA_MM: J16.4(SDA) J17.4(SDA) R33.2 TP33.1 U16.4(A2)
VBUS_5V_MM: C57.2 C58.2 C60.1 C61.1 C62.2 C63.1 C64.1 C65.1 C66.1 C67.1 C68.1 C69.1 J16.2(VCC) J17.2(VCC) R35.2 R36.2 R37.2 R38.2 TP27.1 TP30.1 TP31.1 U15.3(INPUT) U16.7(VCCB) U17.1 U18.1 U19.10(REFIN/REFOUT) U19.16(VDD+) U20.1 U21.1 U22.1 U23.1
NetU17_2: U17.2 U19.1(CH0)
NetU18_2: U18.2 U19.2(CH1)
NetU19_3: U19.3(CH2) U20.2
NetU19_4: U19.4(CH3) U21.2
NetU19_5: U19.5(CH4) U22.2
NetU19_6: U19.6(CH5) U23.2

Not connected (* = marked no-connect by the designer): U19 7(CH6)* 8(CH7)*

### Notes on the sheet
- POWER
- LVL TRANS
- (near J16) MODULE CONNECTORS
- (near U19) 0x48 - 0x4B

### Library data of the parts
C56 C57 C60 C61 C63 C64 C68 C69 = CAP_CL21B105KAFNNNE: as C25 on sheet RMP_LED_MODULE
C58 C59 C62 = CAP_GRM21BR61C106KE15K: as C1 on sheet RMP_MAIN
C65-C67 = CAP_35YXJ100M6.3X11: as C33 on sheet RMP_MAIN_HFB
R32 R33 = CMP-03412-025396-1: as R8 on sheet RMP_LED_MODULE; Category: Res; Footprint Url: http://www.yageo.com/exep/pages/download/literatures/PYu-R_Mount_10.pdf; Package: RT0805; Composition: Thin Film; Device Class L3: Chip SMD Resistors; Ipc Land Pattern Name: RESC200125X50; Temperature Range Low: -55°C; Lead Free: Yes; Temperature Range High: +155°C; Temperature Coefficient: 50 ppm/°C; Octopart: https://octopart.com/rt0805fre134k7l-yageo-16262042; ComponentLink2URL: http://www.yageo.com/documents/recent/PYu-RT_1-to-0.01_RoHS_L_9.pdf; Device Class L1: Passive Components; Value: 4.7KΩ; Automotive: No; Height: 0.6mm; Device Class L2: Resistors; RoHS: TRUE; Manufacturer Part Number: RT0805FRE134K7L; Power Rating: 0.125W; Temperature: -55°C to +155°C; Series: RT; ComponentLink2Description: Datasheet
R34-R40 = RES_RNCP0805FTD10K0: as R10 on sheet RMP_LED_MODULE; Supplier 1: Digikey; Supplier Part Number 1: RNCP0805FTD10K0CT-ND
U15 = NCP1117LPST33T3G: as U1 on sheet RMP_MAIN; RefDes: RefDes; Type: Type
U16 = TXS0102DCTR: as U6 on sheet RMP_LED_MODULE; RefDes: RefDes; Type: Type
U17 U18 U20-U23 = mech_switch: mechanical switch
U19 = ADS7830IPWR: as U14 on sheet RMP_SLIDER_MODULE; RefDes: RefDes; Type: Type

## Sheet RMP_MAIN_ZERO.SchDoc
size Letter; SheetNumber: 6; SheetTotal: 7
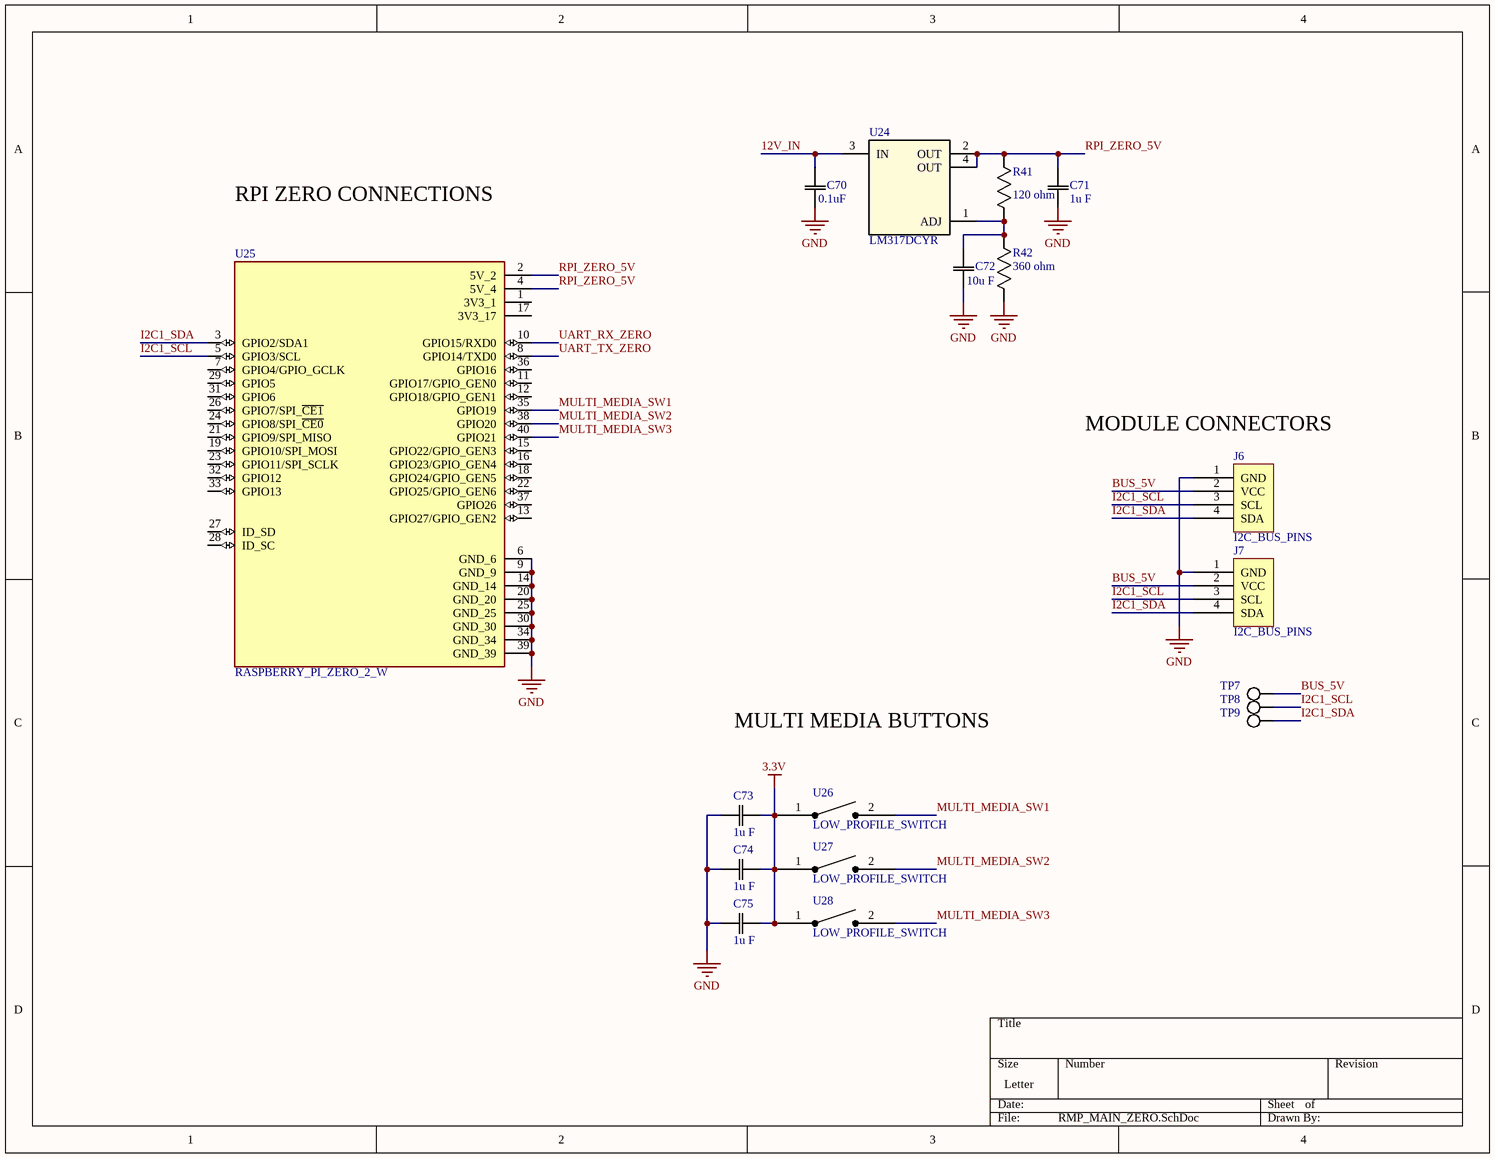
[diagram p5: RMP_MAIN_ZERO.SchDoc]

### Parts
C70  value 0.1uF  [CC0805N_YAG-M]  (hidden comment: CC0805KRX7R9BB104)
C71  value 1u F  [CAP_CL21B105KAFNNNE_SAM-M]  (hidden comment: CL21B105KAFNNNE)
C72  value 10u F  [G-21_MUR-M]  (hidden comment: GRM21BR61C106KE15K)
C73  value 1u F  [CAP_CL21B105KAFNNNE_SAM-M]  (hidden comment: CL21B105KAFNNNE)
C74  value 1u F  [CAP_CL21B105KAFNNNE_SAM-M]  (hidden comment: CL21B105KAFNNNE)
C75  value 1u F  [CAP_CL21B105KAFNNNE_SAM-M]  (hidden comment: CL21B105KAFNNNE)
J6  I2C_BUS_PINS  [4 PIN HEADER]
J7  I2C_BUS_PINS  [4 PIN HEADER]
R41  value 120 ohm  [RES_RNCF0805_STP-M]  (hidden comment: RNCF0805DTE120R)
R42  value 360 ohm  [RES_RNCF0805_STP-M]  (hidden comment: RNCF0805DTE360R)
TP7  TestPoint  [Testpoint]  (value not drawn)
TP8  TestPoint  [Testpoint]  (value not drawn)
TP9  TestPoint  [Testpoint]  (value not drawn)
U24  LM317DCYR  [DCY0004A_M]
U25  RASPBERRY_PI_ZERO_2_W  [MODULE_RASPBERRY_PI_ZERO_2_W]
U26  LOW_PROFILE_SWITCH  [2PINHEADER]
U27  LOW_PROFILE_SWITCH  [2PINHEADER]
U28  LOW_PROFILE_SWITCH  [2PINHEADER]

### Nets
3.3V: C73.1 C74.1 C75.1 U26.1 U27.1 U28.1
GND: C70.1 C71.1 C72.1 C73.2 C74.2 C75.2 J6.1(GND) J7.1(GND) R42.1 U25.6(GND_6) U25.9(GND_9) U25.14(GND_14) U25.20(GND_20) U25.25(GND_25) U25.30(GND_30) U25.34(GND_34) U25.39(GND_39)
12V_IN: C70.2 U24.3(IN)
BUS_5V: J6.2(VCC) J7.2(VCC) TP7.1
I2C1_SCL: J6.3(SCL) J7.3(SCL) TP8.1 U25.5(GPIO3/SCL)
I2C1_SDA: J6.4(SDA) J7.4(SDA) TP9.1 U25.3(GPIO2/SDA1)
MULTI_MEDIA_SW1: U25.35(GPIO19) U26.2
MULTI_MEDIA_SW2: U25.38(GPIO20) U27.2
MULTI_MEDIA_SW3: U25.40(GPIO21) U28.2
RPI_ZERO_5V: C71.2 R41.2 U24.2(OUT) U24.4(OUT) U25.2(5V_2) U25.4(5V_4)
UART_RX_ZERO: U25.10(GPIO15/RXD0)
UART_TX_ZERO: U25.8(GPIO14/TXD0)
NetC72_2: C72.2 R41.1 R42.2 U24.1(ADJ)

Not connected (* = marked no-connect by the designer): U25 1(3V3_1) 7(GPIO4/GPIO_GCLK) 11(GPIO17/GPIO_GEN0) 12(GPIO18/GPIO_GEN1) 13(GPIO27/GPIO_GEN2) 15(GPIO22/GPIO_GEN3) 16(GPIO23/GPIO_GEN4) 17(3V3_17) 18(GPIO24/GPIO_GEN5) 19(GPIO10/SPI_MOSI) 21(GPIO9/SPI_MISO) 22(GPIO25/GPIO_GEN6) 23(GPIO11/SPI_SCLK) 24(GPIO8/SPI_~{CE0}) 26(GPIO7/SPI_~{CE1}) 27(ID_SD) 28(ID_SC) 29(GPIO5) 31(GPIO6) 32(GPIO12) 33(GPIO13) 36(GPIO16) 37(GPIO26)

### Notes on the sheet
- RPI ZERO CONNECTIONS
- (near J6) MODULE CONNECTORS
- MULTI MEDIA BUTTONS

### Library data of the parts
C70 = CAP_CC0805KRX7R9BB104: as C31 on sheet RMP_MAIN_HFB
C71 C73-C75 = CAP_CL21B105KAFNNNE: as C25 on sheet RMP_LED_MODULE
C72 = CAP_GRM21BR61C106KE15K: as C1 on sheet RMP_MAIN
R41 = RES_RNCF0805DTE120R: as R17 on sheet RMP_MAIN_HFB
R42 = RES_RNCF0805DTE360R: as R18 on sheet RMP_MAIN_HFB
U24 = LM317DCYR: as U8 on sheet RMP_MAIN_HFB; TYPE: TYPE; RefDes: RefDes; PartNumber: LM317DCYR; Alternate_PartNumber: LM317DCY; PackageReference: DCY0004A; MountType: SMT; CompType: IC; RoHS: Y; Manufacturer: Texas Instruments
U25 = RASPBERRY_PI_ZERO_2_W: At the heart of Raspberry Pi Zero 2 W is RP3A0, a custom-built system-in-package designed by Raspberry Pi in the UK.; SnapEDA_Link: https://www.snapeda.com/parts/RASPBERRY%20PI%20ZERO%202%20W/Raspberry+Pi/view-part/?ref=snap; Package: None; Value: *; MF: Raspberry Pi; MP: RASPBERRY PI ZERO 2 W; Check_prices: https://www.snapeda.com/parts/RASPBERRY%20PI%20ZERO%202%20W/Raspberry+Pi/view-part/?ref=eda
U26-U28 = LOW_PROFILE_SWITCH: connector for low profile mechanical switch

## Sheet USB_HUB.SchDoc
size A4; SheetNumber: 7; SheetTotal: 7
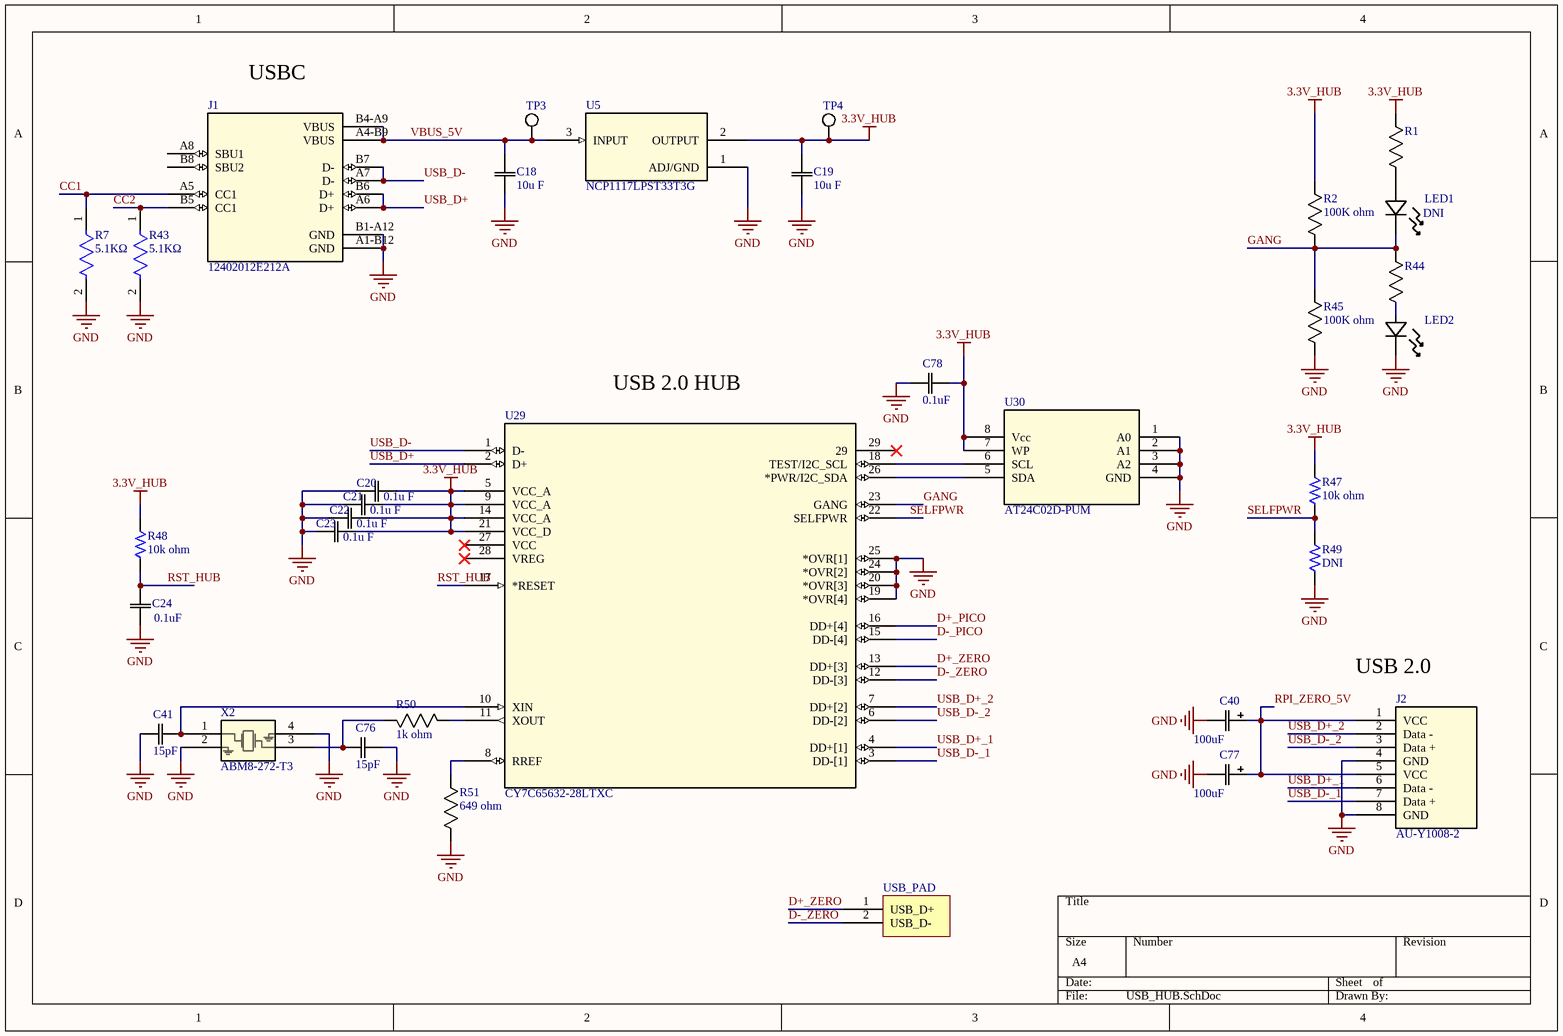
[diagram p6: USB_HUB.SchDoc]

### Parts
C18  value 10u F  [G-21_MUR-M]  (hidden comment: GRM21BR61C106KE15K)
C19  value 10u F  [G-21_MUR-M]  (hidden comment: GRM21BR61C106KE15K)
C20  value 0.1u F  [CC0805N_YAG-M]  (hidden comment: CC0805KRX7R9BB104)
C21  value 0.1u F  [CC0805N_YAG-M]  (hidden comment: CC0805KRX7R9BB104)
C22  value 0.1u F  [CC0805N_YAG-M]  (hidden comment: CC0805KRX7R9BB104)
C23  value 0.1u F  [CC0805N_YAG-M]  (hidden comment: CC0805KRX7R9BB104)
C24  value 0.1uF  [CC0805N_YAG-M]  (hidden comment: CC0805KRX7R9BB104)
C40  value 100uF  [CAP_YX_6P3X11_RUB]  (hidden comment: 35YXJ100M6.3X11)
C41  value 15pF  [CAP_CC0805_YAG-M]  (hidden comment: CC0805FRNPO9BN150)
C76  value 15pF  [CAP_CC0805_YAG-M]  (hidden comment: CC0805FRNPO9BN150)
C77  value 100uF  [CAP_YX_6P3X11_RUB]  (hidden comment: 35YXJ100M6.3X11)
C78  value 0.1uF  [CC0805N_YAG-M]  (hidden comment: CC0805KRX7R9BB104)
J1  12402012E212A  [AMPHENOL_12402012E212A]
J2  AU-Y1008-2  [CONN_AU-Y1008-2_ASM]
LED1  Parameter 1: DNI  [LED_B1931NG_HVK]  (hidden comment: B1931NG--20D001114U1930)
LED2  B1931NG--20D001114U1930  [LED_B1931NG_HVK]  (value not drawn)
R1  RC0603FR-07169RL  [RC0603N_YAG-M]  (value not drawn)
R2  value 100K ohm  [RC0805N_YAG-M]  (hidden comment: RC0805FR-07100KL)
R7  Resistance: 5.1KΩ  [FP-RT0805-MFG]  (hidden comment: RT0805FRE075K1L)
R43  Resistance: 5.1KΩ  [FP-RT0805-MFG]  (hidden comment: RT0805FRE075K1L)
R44  RC0603FR-07169RL  [RC0603N_YAG-M]  (value not drawn)
R45  value 100K ohm  [RC0805N_YAG-M]  (hidden comment: RC0805FR-07100KL)
R47  value 10k ohm  [STA_RNCP0805_STP-M]  (hidden comment: RNCP0805FTD10K0)
R48  value 10k ohm  [STA_RNCP0805_STP-M]  (hidden comment: RNCP0805FTD10K0)
R49  value DNI  [STA_RNCP0805_STP-M]  (hidden comment: RNCP0805FTD10K0)
R50  value 1k ohm  [RES_RNCF0805_STP-M]  (hidden comment: RNCF0805DTE1K00)
R51  value 649 ohm  [RES_RNCF0805_STP-M]  (hidden comment: RLC73K2AR649FTD)
TP3  TestPoint  [Testpoint]  (value not drawn)
TP4  TestPoint  [Testpoint]  (value not drawn)
U5  NCP1117LPST33T3G  [SOT223-3_ONS-M]
U29  CY7C65632-28LTXC  [QFN-28-M]
U30  AT24C02D-PUM  [PDIP8_300MC_MCH]
USB_PAD  USB_PAD  [USB_PAD]  (value not drawn)
X2  ABM8-272-T3  [ABM8-272-T3_ABR]

### Nets
3.3V_HUB: C19.2 C20.1 C21.1 C22.1 C23.1 C78.1 R1.1 R2.2 R47.2 R48.2 TP4.1 U5.2(OUTPUT) U29.5(VCC_A) U29.9(VCC_A) U29.14(VCC_A) U29.21(VCC_D) U30.7(WP) U30.8(Vcc)
GND: C18.1 C19.1 C20.2 C21.2 C22.2 C23.2 C24.1 C40.2 C41.1 C76.2 C77.2 C78.2 J1.A1-B12(GND) J1.B1-A12(GND) J2.4(GND) J2.8(GND) LED2.1(CATHODE) R7.2 R43.2 R45.1 R49.1 R51.1 U5.1(ADJ/GND) U29.19(*OVR[4]) U29.20(*OVR[3]) U29.24(*OVR[2]) U29.25(*OVR[1]) U30.1(A0) U30.2(A1) U30.3(A2) U30.4(GND) X2.2 X2.4
CC1: J1.A5(CC1) R7.1
CC2: J1.B5(CC1) R43.1
D+_PICO: U29.16(DD+[4])
D+_ZERO: U29.13(DD+[3]) USB_PAD.1(USB_D+)
D-_PICO: U29.15(DD-[4])
D-_ZERO: U29.12(DD-[3]) USB_PAD.2(USB_D-)
GANG: LED1.1(CATHODE) R2.1 R44.1 R45.2 U29.23(GANG)
RPI_ZERO_5V: C40.1 C77.1 J2.1(VCC) J2.5(VCC)
RST_HUB: C24.2 R48.1 U29.17(*RESET)
SELFPWR: R47.1 R49.2 U29.22(SELFPWR)
USB_D+: J1.A6(D+) J1.B6(D+) U29.2(D+)
USB_D+_1: J2.6(Data_-) U29.4(DD+[1])
USB_D+_2: J2.2(Data_-) U29.7(DD+[2])
USB_D-: J1.A7(D-) J1.B7(D-) U29.1(D-)
USB_D-_1: J2.7(Data_+) U29.3(DD-[1])
USB_D-_2: J2.3(Data_+) U29.6(DD-[2])
VBUS_5V: C18.2 J1.A4-B9(VBUS) J1.B4-A9(VBUS) TP3.1 U5.3(INPUT)
NetC41_2: C41.2 U29.10(XIN) X2.1
NetC76_1: C76.1 R50.2 X2.3
NetLED1_2: LED1.2(ANODE) R1.2
NetLED2_2: LED2.2(ANODE) R44.2
NetR50_1: R50.1 U29.11(XOUT)
NetR51_2: R51.2 U29.8(RREF)
NetU29_18: U29.18(TEST/I2C_SCL) U30.6(SCL)
NetU29_26: U29.26(*PWR/I2C_SDA) U30.5(SDA)

Not connected (* = marked no-connect by the designer): J1 A8(SBU1) B8(SBU2); U29 27(VCC)* 28(VREG)* 29*

### Notes on the sheet
- (near J1) USBC
- USB 2.0 HUB
- (near J2) USB 2.0

### Library data of the parts
C18 C19 = CAP_GRM21BR61C106KE15K: as C1 on sheet RMP_MAIN
C20-C24 C78 = CAP_CC0805KRX7R9BB104: as C31 on sheet RMP_MAIN_HFB
C40 C77 = CAP_35YXJ100M6.3X11: as C33 on sheet RMP_MAIN_HFB
C41 C76 = CAP_CC0805FRNPO9BN150: as C16 on sheet RMP_MAIN
J1 = 12402012E212A: CONN RCP USB2.0 TYP C 24P SMD RA; Mfr_Name: Amphenol ICC; RefDes: RefDes; Type: Type
J2 = AU-Y1008-2: No Description Available; Mfr_Name: Assmann; RefDes: RefDes; Type: Type
LED1 LED2 = LED_B1931NG--20D001114U1930: Green 525nm LED Indication - Discrete 3.3V 0603 (1608 Metric); Mfr_Name: Harvatek; Type: LED Indication
R1 R44 = RES_RC0603FR-07169RL: 169 Ohms ±1% 0.1W, 1/10W Chip Resistor 0603 (1608 Metric) Moisture Resistant Thick Film; Mfr_Name: Yageo
R2 R45 = RES_RC0805FR-07100KL: 100 kOhms ±1% 0.125W, 1/8W Chip Resistor 0805 (2012 Metric) Moisture Resistant Thick Film; Mfr_Name: Yageo
R7 R43 = CMP-2001-01539-2: RES SMD 5.1K OHM 1% 1/8W 0805; Manufacturer: Yageo; Temperature Coefficient: 50 ppm/°C; Tolerance: 0.0001; Value: 5.1KΩ; Voltage Rating: 150V; Power Rating: 0.125W; Ipc Land Pattern Name: RESC200125X50; Digikey Description: RES SMD 5.1K OHM 1% 1/8W 0805; Composition: Thin Film; Category: Res; Device Class L2: Resistors; Manufacturer Part Number: RT0805FRE075K1L; Octopart: https://octopart.com/rt0805fre075k1l-yageo-1396245; Series: RT; Lead Free: Yes; ComponentLink2URL: http://www.yageo.com/documents/recent/PYu-RT_1-to-0.01_RoHS_L_9.pdf; Height: 0.6mm; Device Class L1: Passive Components; Footprint Url: http://www.yageo.com/exep/pages/download/literatures/PYu-R_Mount_10.pdf; Package: RT0805; Temperature Range Low: -55°C; Automotive: No; RoHS: TRUE; Temperature Range High: +155°C; Temperature: -55°C to +155°C; ComponentLink2Description: Datasheet; Mouser Description: Res Thin Film 0805 5.1K Ohm 1% 1/8W ±50ppm/°C Molded SMD SMD Paper T/R; Device Class L3: Chip SMD Resistors
R47-R49 = RES_RNCP0805FTD10K0: as R10 on sheet RMP_LED_MODULE; Supplier 1: Digikey; Supplier Part Number 1: RNCP0805FTD10K0CT-ND
R50 = RES_RNCF0805DTE1K00: as R3 on sheet RMP_MAIN
R51 = RES_RLC73K2AR649FTD: 649 mOhms ±1% 0.125W, 1/8W Chip Resistor 0805 (2012 Metric) Current Sense Thick Film; Mfr_Name: Stackpole International
U5 = NCP1117LPST33T3G: as U1 on sheet RMP_MAIN; RefDes: RefDes; Type: Type
U29 = CY7C65632-28LTXC: USB Hub Controller USB 2.0 USB Interface 28-QFN (5x5); Mfr_Name: Cypress Semiconductor; RefDes: RefDes; Type: Type
U30 = AT24C02D-PUM: IC EEPROM 2KBIT I2C 1MHZ 8DIP; Mfr_Name: Microchip; RefDes: RefDes; Type: Type
X2 = ABM8-272-T3: as X1 on sheet RMP_MAIN; Type: Crystals; RefDes: RefDes

## Nets that join several sheets
3.3V: RMP_MAIN (23 pins), RMP_MAIN_HFB (C45.2 J13.1 SW1.1), RMP_MAIN_ZERO (6 pins)
GND: RMP_MAIN (25 pins), RMP_LED_MODULE (13 pins), RMP_MAIN_HFB (32 pins), RMP_SLIDER_MODULE (30 pins), RMP_MACRO_MODULE (23 pins), RMP_MAIN_ZERO (17 pins), USB_HUB (33 pins)
12V_IN: RMP_MAIN (C1.2 TP1.1 U1.3), RMP_MAIN_HFB (6 pins), RMP_MAIN_ZERO (C70.2 U24.3)
BUS_5V: RMP_MAIN_HFB (C38.2 R17.2 U8.2 U8.4), RMP_MAIN_ZERO (J6.2 J7.2 TP7.1)
D+_PICO: RMP_MAIN (R4.2), USB_HUB (U29.16)
D-_PICO: RMP_MAIN (R5.2), USB_HUB (U29.15)
EN1: RMP_MAIN (U2.13), RMP_MAIN_HFB (U7.26)
EN2: RMP_MAIN (U2.14), RMP_MAIN_HFB (U7.24)
EN3: RMP_MAIN (U2.15), RMP_MAIN_HFB (U7.22)
FAULT: RMP_MAIN (U2.9), RMP_MAIN_HFB (R16.2 U7.18)
I2C0_SCL: RMP_MAIN (U2.3), RMP_MAIN_HFB (J13.5)
I2C0_SDA: RMP_MAIN (U2.2), RMP_MAIN_HFB (J13.4)
IN1: RMP_MAIN (U2.4), RMP_MAIN_HFB (U7.27)
IN2: RMP_MAIN (U2.5), RMP_MAIN_HFB (U7.25)
IN3: RMP_MAIN (U2.6), RMP_MAIN_HFB (U7.23)
KNOB_PRESS: RMP_MAIN (U2.37), RMP_MAIN_HFB (SW1.2)
RESET: RMP_MAIN (U2.12), RMP_MAIN_HFB (U7.16)
RPI_ZERO_5V: RMP_MAIN_ZERO (6 pins), USB_HUB (C40.1 C77.1 J2.1 J2.5)
SLEEP: RMP_MAIN (U2.11), RMP_MAIN_HFB (U7.17)
UART_RX_ZERO: RMP_MAIN (U2.27), RMP_MAIN_ZERO (U25.10)
UART_TX_ZERO: RMP_MAIN (U2.28), RMP_MAIN_ZERO (U25.8)